# Altium schematic sheet Power Generation - Connector.SchDoc: [3] Power Generation - Connector
size A4; ApprovedBy: Nagy Richard; CheckedBy: Nagy Richard; Author: Nagy Richard; CompanyName: EmbedCore; DrawnBy: Nagy Richard; Engineer: Nagy Richard; Organization: EmbedCore; Revision: 1.0; SheetNumber: 3; SheetTotal: 24
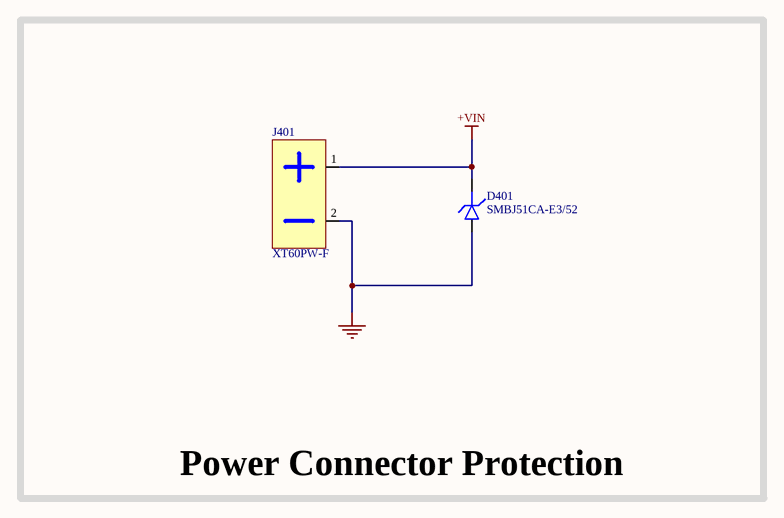
[diagram p0: Power Generation - Connector.SchDoc]

## Parts
D401  SMBJ51CA-E3/52
J401  XT60PW-F  [XT60PW-F]

## Blocks framed on the sheet
Power Connector Protection: D401 J401

## Nets
+VIN: D401.1(K) J401.1(V+)
GND: D401.2(A) J401.2(V-)

## Notes on the sheet
- Title:
- Drawn By:
- Page Contents:
- Checked By:
- Size:
- Date:
- File:
- License:
- Email:
- A4
- Number:
- Time:
- Revision:
- Sheet
- Website:
- of

## Library data of the parts
D401 = D_SMB_TVS
J401 = XT60PW-F: XT60 horizontal female 2-pin AMASS; Manufacturer: AMASS; Manufacturer Part Number: XT60PW-F; Distributor Link: https://www.tme.eu/de/details/xt60pw-f/dc-steckverbinder/amass/